# Altium project shoubing.PrjPCB
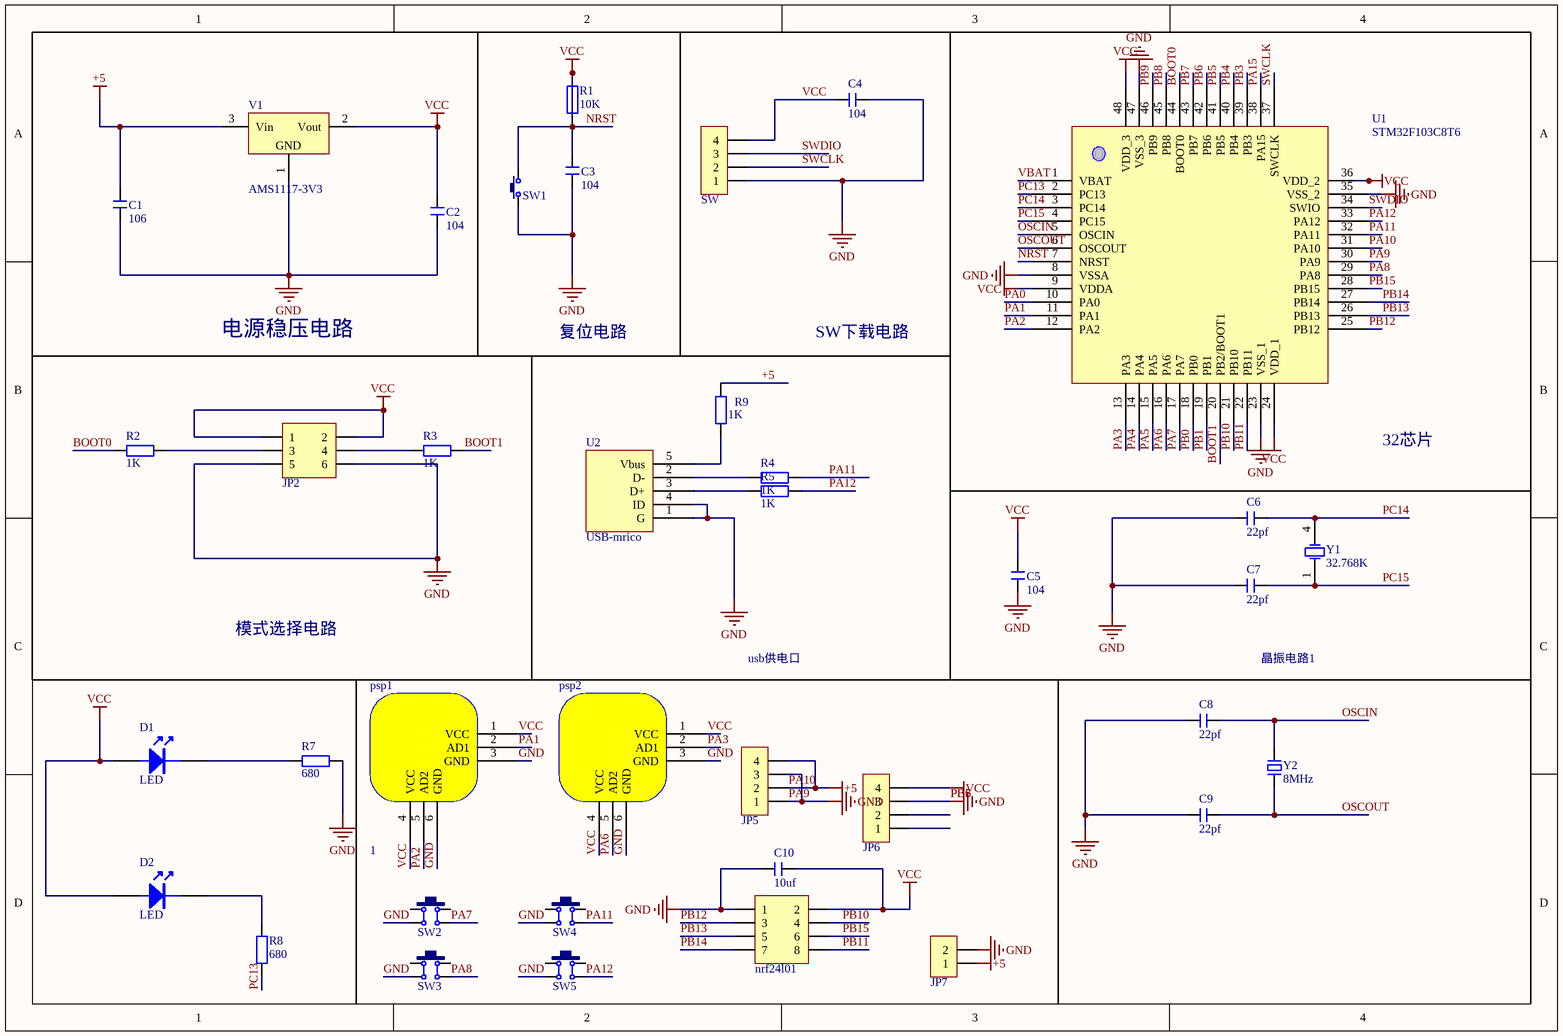
[diagram p0: Sheet1.SchDoc]
1 sheet, 38 parts. Net scope: global (net labels, ports and power ports of the same name join across sheets).
Board file: joy.PcbDoc

## Sheet Sheet1.SchDoc
size A4

### Parts
C1  106  [C 0805_L]
C2  104  [C 0805_L]
C3  104  [C 0805_L]
C4  104  [C 0805_L]
C5  104  [C 0805_L]
C6  22pf  [C 0805_L]
C7  22pf  [C 0805_L]
C8  22pf  [C 0805_L]
C9  22pf  [C 0805_L]
C10  10uf  [C 0805_L]
D1  LED  [LED 0805G]
D2  LED  [LED 0805G]
JP2  Header3X2  [HDR2.54-LI-2x3P]  (value not drawn)
JP5  HDR-1X4  [HDR2.54-M-LI-4P]  (value not drawn)
JP6  HDR-1X4  [HDR2.54-M-LI-4P]  (value not drawn)
JP7  HDR-1X2  [HDR2.54-WI-2P]  (value not drawn)
nrf24l01  Header 4X2  [HDR2.54-LI-2x4P]  (value not drawn)
psp1  1  [PSP摇杆]
psp2  (no value)  [PSP摇杆]
R1  10K  [R 0805_L]
R2  1K  [R 0805_L]
R3  1K  [R 0805_L]
R4  1K  [R 0805_L]
R5  1K  [R 0805_L]
R7  680  [R 0805_L]
R8  680  [R 0805_L]
R9  1K  [R 0805_L]
SW  HDR-1X4  [HDR2.54-WI-4P]  (value not drawn)
SW1  3x6x5  [TSW SMD-3*6*2.5]  (value not drawn)
SW2  6x6x5  [TSW DIP-6*6*6]  (value not drawn)
SW3  6x6x5  [TSW DIP-6*6*6]  (value not drawn)
SW4  6x6x5  [TSW DIP-6*6*6]  (value not drawn)
SW5  6x6x5  [TSW DIP-6*6*6]  (value not drawn)
U1  STM32F103C8T6  [TQFP48 7x7_L]
U2  USB-mrico  [USB-micro_B]
V1  AMS1117-3V3  [SOT223_L]
Y1  32.768K  [MC-306]
Y2  8MHz  [OSC HC-49S]

### Blocks framed on the sheet
电源稳压电路: C1 C2 V1

### Nets
+5: C1.2 JP5.2 JP5.4 JP7.1 R9.2 U1.31(PA10) V1.3(Vin)  [also labelled PA10]
GND: C1.1 C2.1 C3.1 C4.1 C5.1 C6.2 C7.2 C8.1 C9.1 C10.1 JP2.5 JP2.6 JP5.1 JP5.3 JP6.3 JP7.2 nrf24l01.1 psp1.3(GND) psp1.6(GND) psp2.3(GND) psp2.6(GND) R7.1 SW.1 SW1.1 SW2.4 SW3.4 SW4.4 SW5.4 U1.8(VSSA) U1.23(VSS_1) U1.30(PA9) U1.35(VSS_2) U1.41(PB5) U1.42(PB6) U1.47(VSS_3) U2.1(G) U2.4(ID) V1.1(GND)  [also labelled PA9, PB5, PB6]
VCC: C2.2 C4.2 C5.2 C10.2 D1.1 D2.1 JP2.1 JP2.2 JP6.4 nrf24l01.2 psp1.1(VCC) psp1.4(VCC) psp2.1(VCC) psp2.4(VCC) R1.2 SW.4 U1.9(VDDA) U1.24(VDD_1) U1.36(VDD_2) U1.48(VDD_3) V1.2(Vout)
BOOT0: R2.1 U1.44(BOOT0)
BOOT1: R3.2 U1.20(PB2/BOOT1)
NRST: C3.2 R1.1 SW1.2 U1.7(NRST)
OSCIN: C8.2 U1.5(OSCIN) Y2.2
OSCOUT: C9.2 U1.6(OSCOUT) Y2.1
PA0: U1.10(PA0)
PA1: psp1.2(AD1) U1.11(PA1)
PA2: psp1.5(AD2) U1.12(PA2)
PA3: psp2.2(AD1) U1.13(PA3)
PA4: U1.14(PA4)
PA5: U1.15(PA5)
PA6: psp2.5(AD2) U1.16(PA6)
PA7: SW2.3 U1.17(PA7)
PA8: SW3.3 U1.29(PA8)
PA11: R4.2 SW4.3 U1.32(PA11)
PA12: R5.2 SW5.3 U1.33(PA12)
PA15: U1.38(PA15)
PB0: U1.18(PB0)
PB1: U1.19(PB1)
PB3: U1.39(PB3)
PB4: U1.40(PB4)
PB7: U1.43(PB7)
PB8: U1.45(PB8)
PB9: U1.46(PB9)
PB10: nrf24l01.4 U1.21(PB10)
PB11: nrf24l01.8 U1.22(PB11)
PB12: nrf24l01.3 U1.25(PB12)
PB13: nrf24l01.5 U1.26(PB13)
PB14: nrf24l01.7 U1.27(PB14)
PB15: nrf24l01.6 U1.28(PB15)
PC13: R8.2 U1.2(PC13)
PC14: C6.1 U1.3(PC14) Y1.4(OSC2)
PC15: C7.1 U1.4(PC15) Y1.1(OSC1)
SWCLK: SW.2 U1.37(SWCLK)
SWDIO: SW.3 U1.34(SWIO)
VBAT: U1.1(VBAT)
NetD1_2: D1.2 R7.2
NetD2_2: D2.2 R8.1
NetJP2_3: JP2.3 R2.2
NetJP2_4: JP2.4 R3.1
NetR4_1: R4.1 U2.2(D-)
NetR5_1: R5.1 U2.3(D+)
NetR9_1: R9.1 U2.5(Vbus)

Not connected (* = marked no-connect by the designer): JP6 1 2; SW2 1 2; SW3 1 2; SW4 1 2; SW5 1 2

### Notes on the sheet
- 复位电路
- SW下载电路
- 32芯片
- 模式选择电路
- usb供电口
- 晶振电路1

### Library data of the parts
C1-C10 = C: 贴片电容; BOM名称: 无极性贴片电容; 淘宝ID: 封装库来自淘宝 ID：黄晶宝石; 联系售后，技术支持: https://shop463601444.taobao.com; 唯一出售店铺网址: https://shop463601444.taobao.com
JP2 = Header 3X2: 3*2P接插件; 版权归属: 封装库来自淘宝 ID：黄晶宝石; BOM名称: 3*2P接插件; 学习资源: https://shop463601444.taobao.com
JP5 JP6 SW = Header 4: 4P接插件; 版权归属: 封装库来自淘宝 ID：黄晶宝石; BOM名称: 4P接插件; 学习资源: https://shop463601444.taobao.com
JP7 = Header 2: 2P接插件; 版权归属: 封装库来自淘宝 ID：黄晶宝石; BOM名称: 2P接插件; 联系售后: https://shop463601444.taobao.com
nrf24l01 = Header 4X2: 4*2P接插件; 版权归属: 封装库来自淘宝 ID：黄晶宝石; BOM名称: 4*2P接插件; 学习资源: https://shop463601444.taobao.com
psp1 psp2 = PSP摇杆
R1-R5 R7-R9 = R: 贴片电阻; 版权归属: 来自淘宝 ID：黄晶宝石; 封装库来自淘宝卖家 ID：黄晶宝石: 其他店铺购入均为盗版，不享受售后技术支持服务，请立即申请退款; BOM名称: 贴片电阻; 联系售后: https://shop463601444.taobao.com
SW1 = TSW 3x6: 3x6轻触开关; 版权归属: 封装库来自淘宝 ID：黄晶宝石; BOM名称: 3x6轻触开关; 学习资源: https://shop463601444.taobao.com
SW2-SW5 = TSW DIP-6x6: 直插6x6轻触开关; 版权归属: 封装库来自淘宝 ID：黄晶宝石; BOM名称: 直插6x6轻触开关; 唯一出售店铺网址: https://shop463601444.taobao.com
U2 = usb-STM
V1 = AMS1117: 三端稳压芯片; BOM名称: 稳压芯片; 淘宝ID: 封装库来自淘宝 ID：黄晶宝石; 欢迎光临淘宝店铺: https://shop463601444.taobao.com
Y1 = XTAL: Published: 8-Jun-2000; LatestRevisionDate: 17-Jul-2002; LatestRevisionNote: Re-released for DXP Platform.; Publisher: Altium Limited
Y2 = XTAL-2P: 2脚无源脚晶振; 版权归属: 封装库来自淘宝卖家 ID：黄晶宝石; BOM名称: 2脚无源脚晶振; 学习资源: https://shop463601444.taobao.com